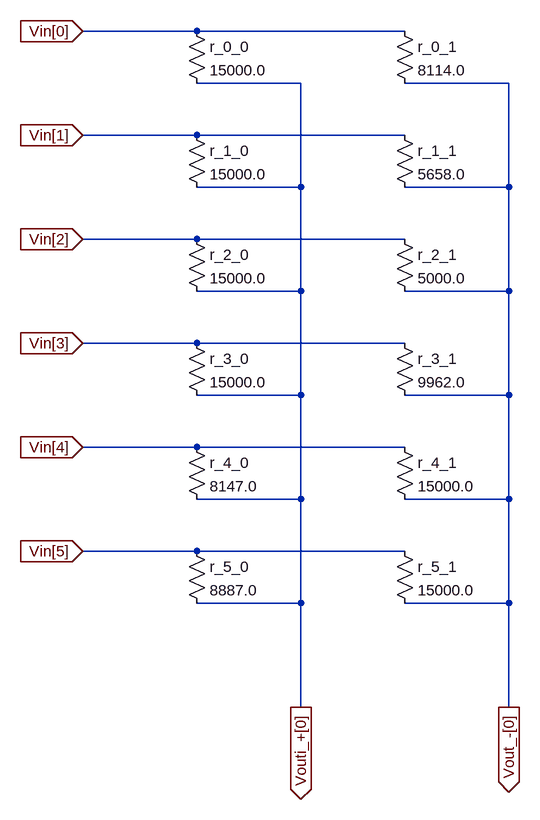
[diagram p0: schematic X_cbar_6by2.asc]
X_cbar_6by2.asc, the LTspice schematic file:
Version 4
SHEET 1 2360 1244
WIRE 16 16 -160 16
WIRE 336 16 16 16
WIRE 176 96 16 96
WIRE 496 96 336 96
WIRE 16 176 -160 176
WIRE 336 176 16 176
WIRE 176 256 176 96
WIRE 176 256 16 256
WIRE 496 256 496 96
WIRE 496 256 336 256
WIRE 16 336 -160 336
WIRE 336 336 16 336
WIRE 176 416 176 256
WIRE 176 416 16 416
WIRE 496 416 496 256
WIRE 496 416 336 416
WIRE 16 496 -160 496
WIRE 336 496 16 496
WIRE 176 576 176 416
WIRE 176 576 16 576
WIRE 496 576 496 416
WIRE 496 576 336 576
WIRE 16 656 -160 656
WIRE 336 656 16 656
WIRE 176 736 176 576
WIRE 176 736 16 736
WIRE 496 736 496 576
WIRE 496 736 336 736
WIRE 16 816 -160 816
WIRE 336 816 16 816
WIRE 176 896 176 736
WIRE 176 896 16 896
WIRE 496 896 496 736
WIRE 496 896 336 896
WIRE 176 1056 176 896
WIRE 496 1056 496 896
FLAG -160 16 Vin[0]
IOPIN -160 16 In
FLAG -160 176 Vin[1]
IOPIN -160 176 In
FLAG -160 336 Vin[2]
IOPIN -160 336 In
FLAG -160 496 Vin[3]
IOPIN -160 496 In
FLAG -160 656 Vin[4]
IOPIN -160 656 In
FLAG -160 816 Vin[5]
IOPIN -160 816 In
FLAG 176 1056 Vouti_+[0]
IOPIN 176 1056 Out
FLAG 496 1056 Vout_-[0]
IOPIN 496 1056 Out
SYMBOL res 0 0 R0
SYMATTR InstName r_0_0
SYMATTR Value 15000.0
SYMBOL res 320 0 R0
SYMATTR InstName r_0_1
SYMATTR Value 8114.0
SYMBOL res 0 160 R0
SYMATTR InstName r_1_0
SYMATTR Value 15000.0
SYMBOL res 320 160 R0
SYMATTR InstName r_1_1
SYMATTR Value 5658.0
SYMBOL res 0 320 R0
SYMATTR InstName r_2_0
SYMATTR Value 15000.0
SYMBOL res 320 320 R0
SYMATTR InstName r_2_1
SYMATTR Value 5000.0
SYMBOL res 0 480 R0
SYMATTR InstName r_3_0
SYMATTR Value 15000.0
SYMBOL res 320 480 R0
SYMATTR InstName r_3_1
SYMATTR Value 9962.0
SYMBOL res 0 640 R0
SYMATTR InstName r_4_0
SYMATTR Value 8147.0
SYMBOL res 320 640 R0
SYMATTR InstName r_4_1
SYMATTR Value 15000.0
SYMBOL res 0 800 R0
SYMATTR InstName r_5_0
SYMATTR Value 8887.0
SYMBOL res 320 800 R0
SYMATTR InstName r_5_1
SYMATTR Value 15000.0

The netlist it stands for:
* X_cbar_6by2.asc
r_0_0 Vin[0] Vouti_+[0] 15000.0
r_0_1 Vin[0] Vout_-[0] 8114.0
r_1_0 Vin[1] Vouti_+[0] 15000.0
r_1_1 Vin[1] Vout_-[0] 5658.0
r_2_0 Vin[2] Vouti_+[0] 15000.0
r_2_1 Vin[2] Vout_-[0] 5000.0
r_3_0 Vin[3] Vouti_+[0] 15000.0
r_3_1 Vin[3] Vout_-[0] 9962.0
r_4_0 Vin[4] Vouti_+[0] 8147.0
r_4_1 Vin[4] Vout_-[0] 15000.0
r_5_0 Vin[5] Vouti_+[0] 8887.0
r_5_1 Vin[5] Vout_-[0] 15000.0
.backanno
.end